# Altium schematic sheet MainLogic.SchDoc
size A2; SheetNumber: 1; SheetTotal: 1
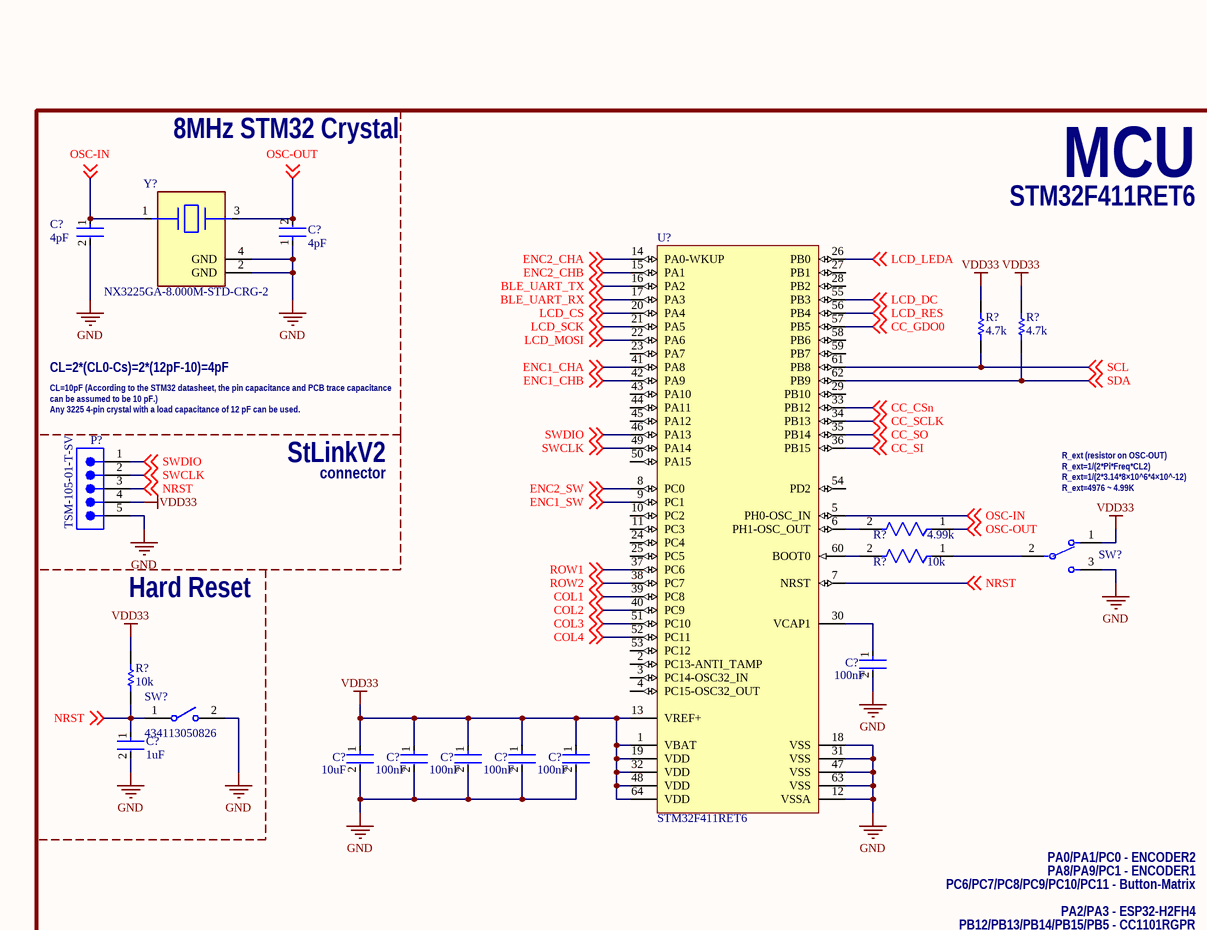
[diagram p0: MainLogic.SchDoc, top left]
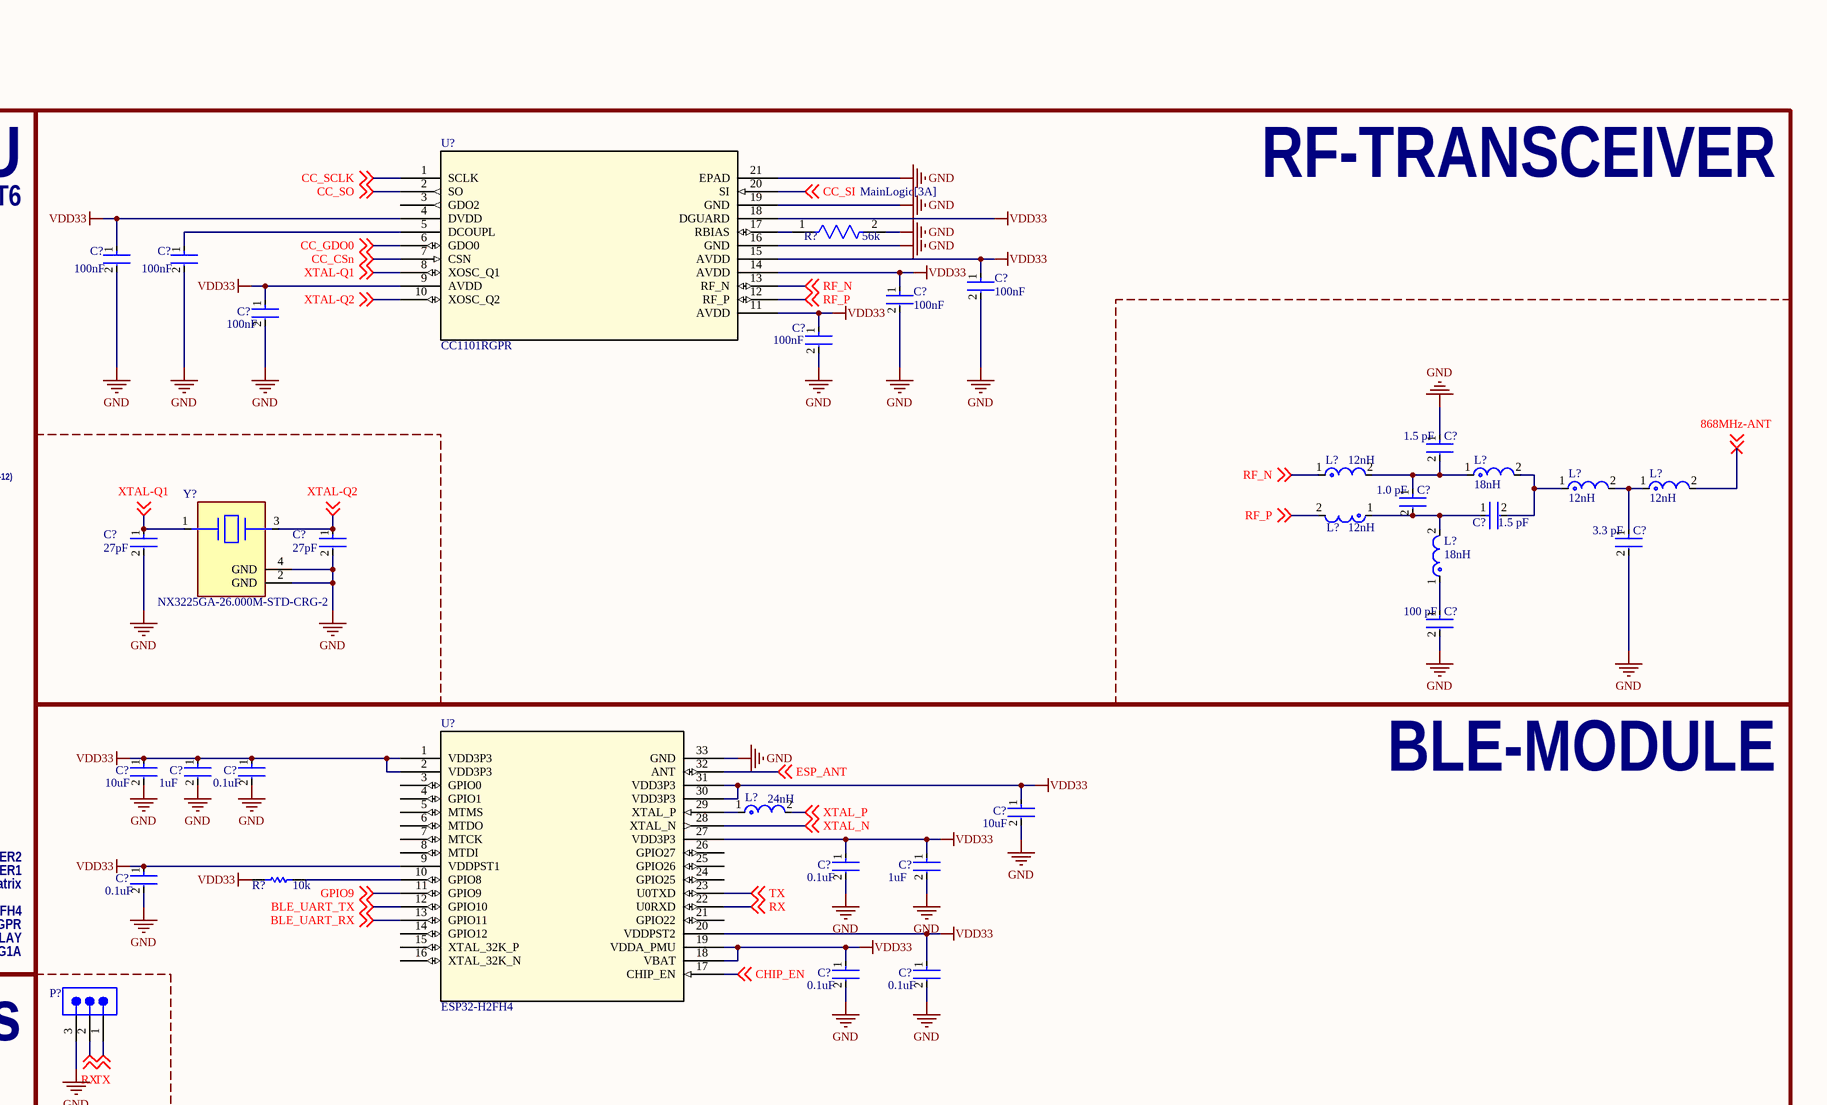
[diagram p1: MainLogic.SchDoc, top right]
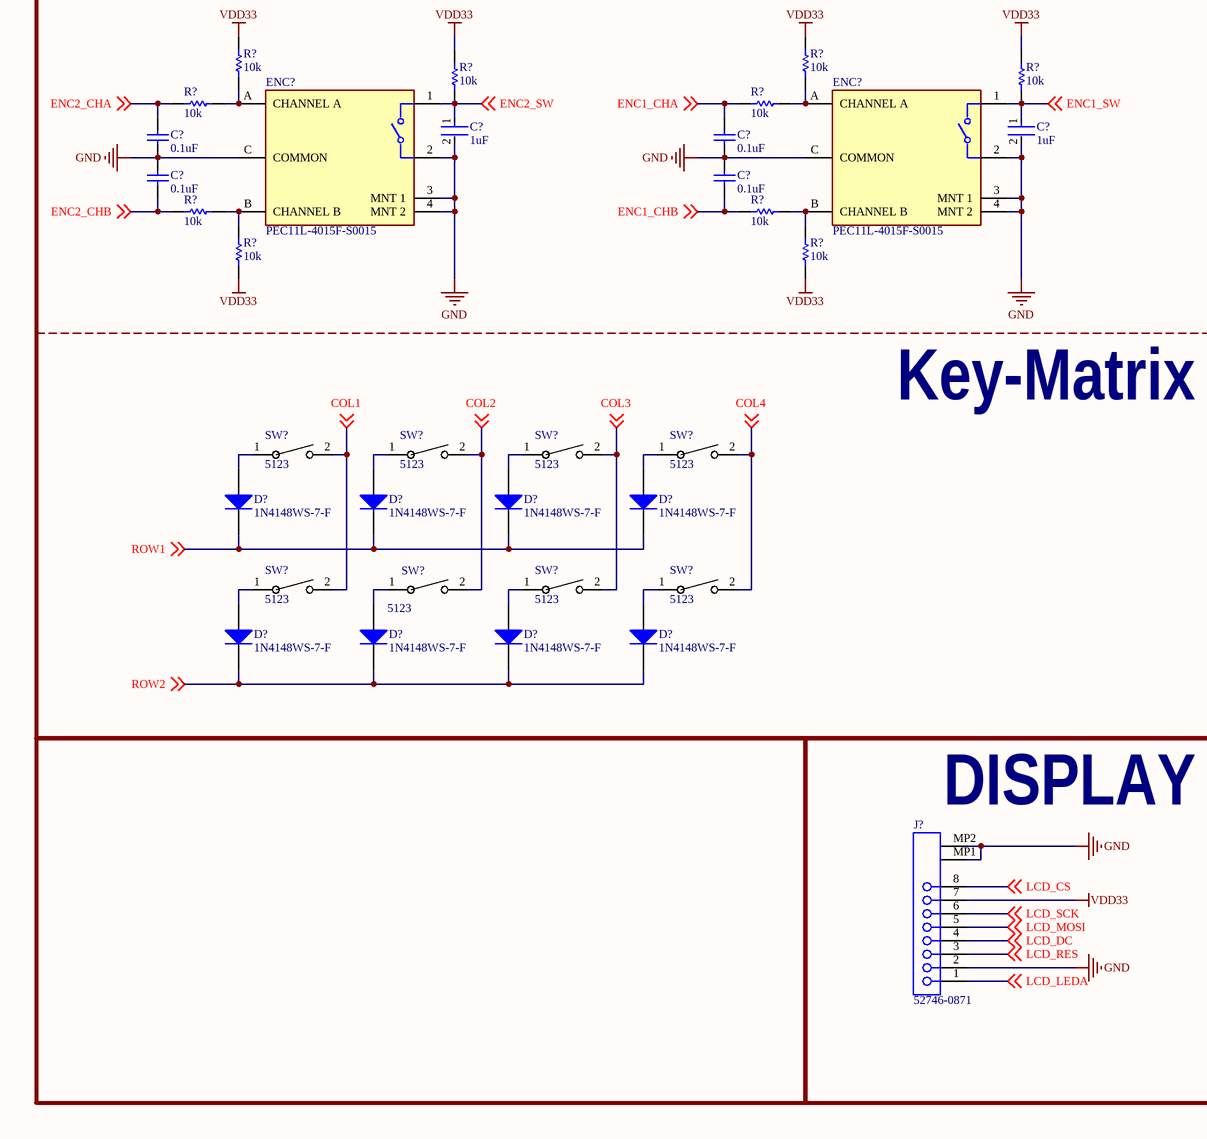
[diagram p2: MainLogic.SchDoc, bottom left]
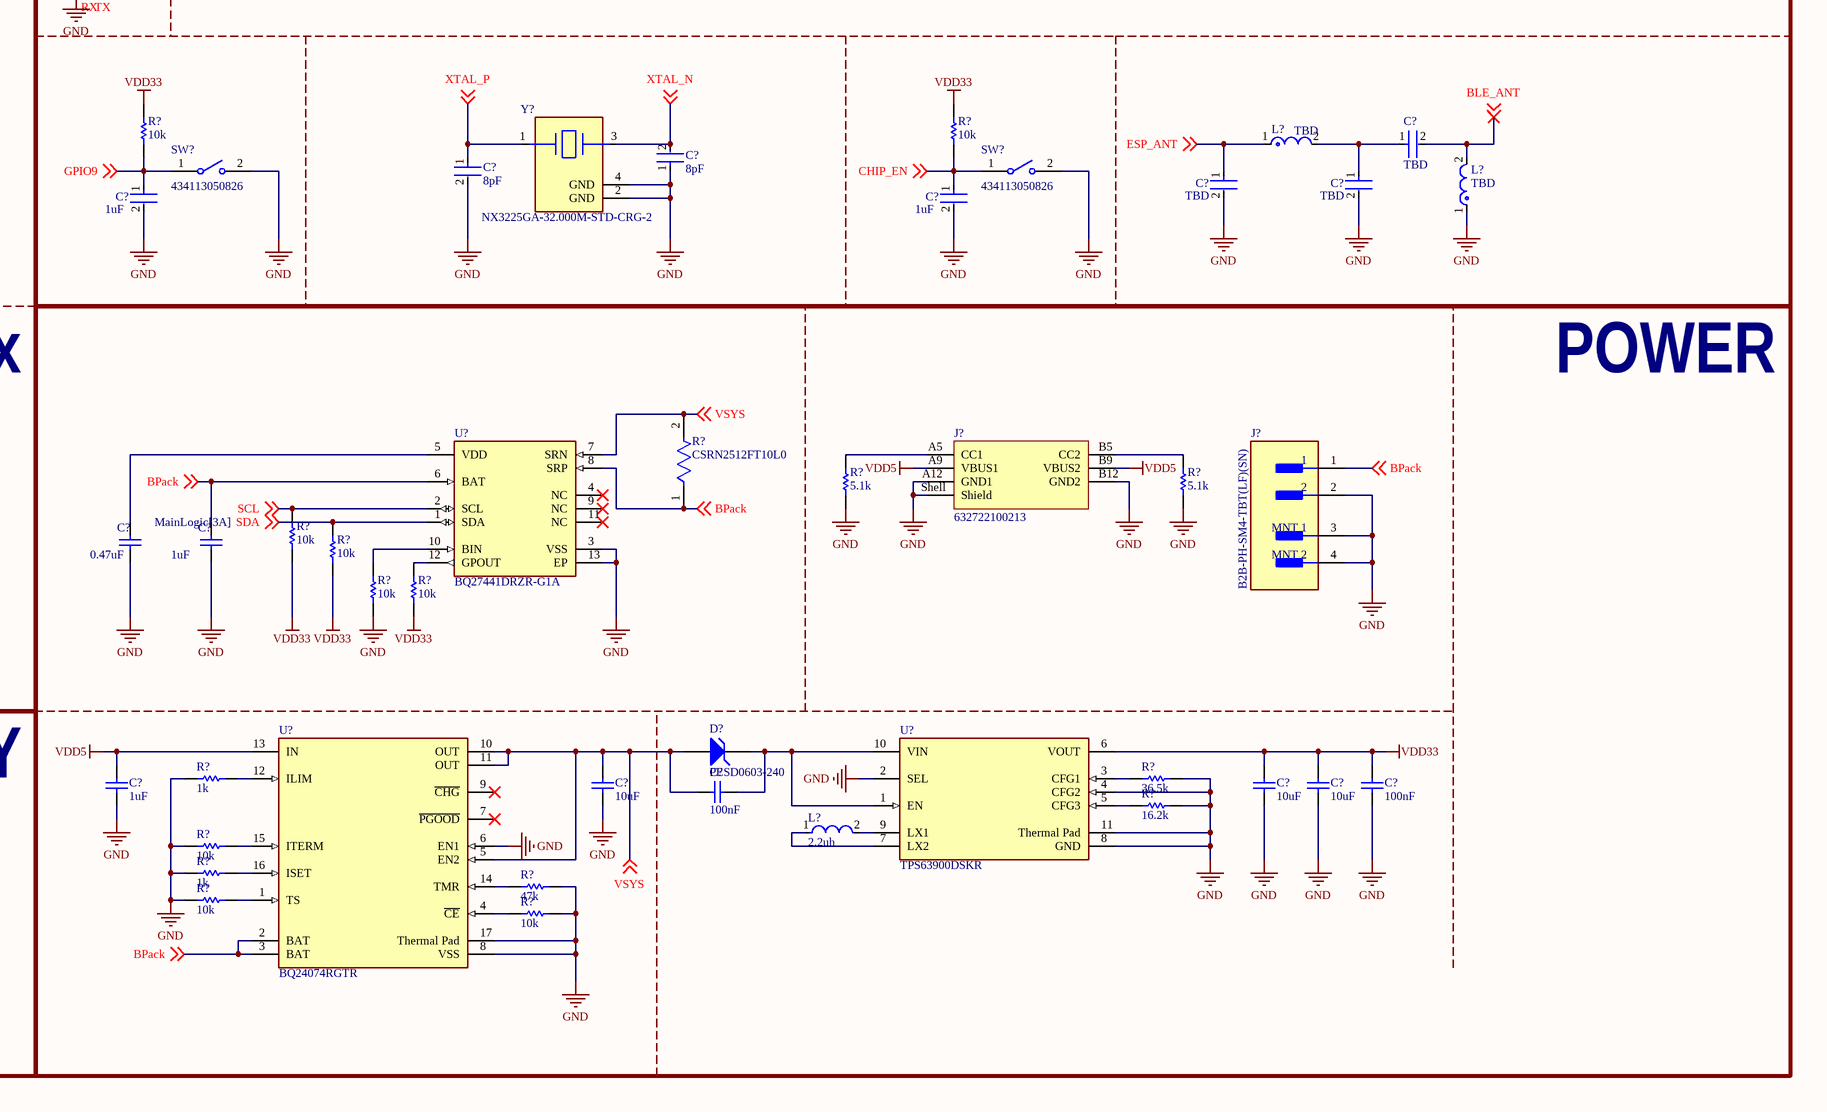
[diagram p3: MainLogic.SchDoc, bottom right]

## Parts
(Parts that share a designator on the sheet are numbered #1, #2 ... from top to bottom, then left to right.)
C?#1  4pF  [FP-GRM155-0_05-IPC_A]
C?#2  4pF  [FP-GRM155-0_05-IPC_A]
C?#3  100nF  [FP-GRM155-0_05-MFG]
C?#4  100nF  [FP-GRM155-0_05-MFG]
C?#5  100nF  [FP-GRM155-0_05-MFG]
C?#6  100nF  [FP-GRM155-0_05-MFG]
C?#7  100nF  [FP-GRM155-0_05-MFG]
C?#8  100nF  [FP-GRM155-0_05-MFG]
C?#9  1.5 pF  [FP-GRM155-0_05-IPC_A]
C?#10  1.0 pF  [FP-GRM155-0_05-IPC_A]
C?#11  1.5 pF  [FP-GRM155-0_05-IPC_A]
C?#12  27pF  [FP-GRM155-0_05-IPC_A]
C?#13  27pF  [FP-GRM155-0_05-IPC_A]
C?#14  3.3 pF  [FP-GRM155-0_05-IPC_A]
C?#15  100 pF  [FP-GRM155-0_05-IPC_A]
C?#16  100nF  [FP-GRM155-0_05-MFG]
C?#17  1uF  [FP-GRM155-0_05-MFG]
C?#18  10uF  [FP-GRM155-0_05-MFG]
C?#19  100nF  [FP-GRM155-0_05-MFG]
C?#20  100nF  [FP-GRM155-0_05-MFG]
C?#21  100nF  [FP-GRM155-0_05-MFG]
C?#22  100nF  [FP-GRM155-0_05-MFG]
C?#23  10uF  [FP-GRM155-0_05-MFG]
C?#24  1uF  [FP-GRM155-0_05-MFG]
C?#25  0.1uF  [FP-GRM155-0_05-MFG]
C?#26  10uF  [FP-GRM155-0_05-MFG]
C?#27  0.1uF  [FP-GRM155-0_05-MFG]
C?#28  1uF  [FP-GRM155-0_05-MFG]
C?#29  0.1uF  [FP-GRM155-0_05-MFG]
C?#30  0.1uF  [FP-GRM155-0_05-MFG]
C?#31  0.1uF  [FP-GRM155-0_05-MFG]
C?#32  1uF  [FP-GRM155-0_05-MFG]
C?#33  1uF  [FP-GRM155-0_05-MFG]
C?#34  0.1uF  [CAPC2013X94X50NL20T25]
C?#35  0.1uF  [CAPC2013X94X50NL20T25]
C?#36  TBD  [FP-GRM155-0_05-MFG]
C?#37  0.1uF  [CAPC2013X94X50NL20T25]
C?#38  0.1uF  [CAPC2013X94X50NL20T25]
C?#39  8pF  [FP-GRM155-0_05-IPC_A]
C?#40  8pF  [FP-GRM155-0_05-IPC_A]
C?#41  TBD  [FP-GRM155-0_05-MFG]
C?#42  TBD  [FP-GRM155-0_05-MFG]
C?#43  1uF  [FP-GRM155-0_05-MFG]
C?#44  1uF  [FP-GRM155-0_05-MFG]
C?#45  0.47uF  [CAPC2013X94X50NL20T25]
C?#46  1uF  [CAPC2013X94X50NL20T25]
C?#47  10uF  [CAPC2013X94X50NL20T25]
C?#48  10uF  [CAPC2013X94X50NL20T25]
C?#49  100nF  [CAPC2013X94X50NL20T25]
C?#50  1uF  [CAPC2013X94X50NL20T25]
C?#51  10uF  [CAPC2013X94X50NL20T25]
C?#52  100nF  [CAPC2013X94X50NL20T25]
D?#1  1N4148WS-7-F  [DIOD-SOD323-2-A_V]
D?#2  1N4148WS-7-F  [DIOD-SOD323-2-A_V]
D?#3  1N4148WS-7-F  [DIOD-SOD323-2-A_V]
D?#4  1N4148WS-7-F  [DIOD-SOD323-2-A_V]
D?#5  1N4148WS-7-F  [DIOD-SOD323-2-A_V]
D?#6  1N4148WS-7-F  [DIOD-SOD323-2-A_V]
D?#7  1N4148WS-7-F  [DIOD-SOD323-2-A_V]
D?#8  1N4148WS-7-F  [DIOD-SOD323-2-A_V]
D?#9  PESD0603-240  [TECO-0603_V]
ENC?#1  PEC11L-4015F-S0015  [FP-PEC11L-4015F-S0015-MFG]
ENC?#2  PEC11L-4015F-S0015  [FP-PEC11L-4015F-S0015-MFG]
J?#1  632722100213  [632722100213]
J?#2  B2B-PH-SM4-TBT(LF)(SN)  [FP-B2B-PH-SM4-TBT_LF_SN-MFG]
J?#3  52746-0871  [MOLX-52746-0871]
L?#1  12nH  [FP-LQG15WH_02-IPC_C]
L?#2  18nH  [FP-LQG15WH_02-IPC_C]
L?#3  12nH  [FP-LQG15WH_02-IPC_C]
L?#4  12nH  [FP-LQG15WH_02-IPC_C]
L?#5  12nH  [FP-LQG15WH_02-IPC_C]
L?#6  18nH  [FP-LQG15WH_02-IPC_C]
L?#7  24nH  [FP-LQG15WH_02-MFG]
L?#8  TBD  [FP-LQG15WH_02-MFG]
L?#9  TBD  [FP-LQG15WH_02-MFG]
L?#10  2.2uh  [FP-IHLP-5050FD-FP_3_226x4-MFG]
P?#1  TSM-105-01-T-SV  [SMTC-TSM-105-01-X-SV]
P?#2  MTSW-103-08-G-S-229-RA  [SMTC-MTSW-103-08-X-S-229-RA]  (value not drawn)
R?#1  56k  [FP-CRGCQ0402-IPC_C]
R?#2  4.7k  [RESC0805(2012)_M]
R?#3  4.7k  [RESC0805(2012)_M]
R?#4  4.99k  [FP-CRGCQ0402-IPC_C]
R?#5  10k  [FP-CRGCQ0402-IPC_C]
R?#6  10k  [RESC0805(2012)_M]
R?#7  10k  [RESC0805(2012)_M]
R?#8  10k  [RESC0805(2012)_M]
R?#9  10k  [RESC0805(2012)_M]
R?#10  10k  [RESC0805(2012)_M]
R?#11  10k  [RESC0805(2012)_M]
R?#12  10k  [RESC0805(2012)_M]
R?#13  10k  [RESC0805(2012)_M]
R?#14  10k  [RESC0805(2012)_M]
R?#15  10k  [RESC0805(2012)_M]
R?#16  10k  [RESC0805(2012)_M]
R?#17  10k  [RESC0805(2012)_M]
R?#18  10k  [RESC0805(2012)_M]
R?#19  10k  [RESC0805(2012)_M]
R?#20  5.1k  [RESC0805(2012)_M]
R?#21  5.1k  [RESC0805(2012)_M]
R?#22  CSRN2512FT10L0  [FP-CSRN2512-IPC_B]
R?#23  10k  [RESC0805(2012)_M]
R?#24  10k  [RESC0805(2012)_M]
R?#25  10k  [RESC0805(2012)_M]
R?#26  10k  [RESC0805(2012)_M]
R?#27  1k  [RESC0805(2012)_M]
R?#28  36.5k  [RESC0805(2012)_M]
R?#29  16.2k  [RESC0805(2012)_M]
R?#30  10k  [RESC0805(2012)_M]
R?#31  1k  [RESC0805(2012)_M]
R?#32  47k  [RESC0805(2012)_M]
R?#33  10k  [RESC0805(2012)_M]
R?#34  10k  [RESC0805(2012)_M]
SW?#1  (no value)  [FP-JS102011SAQN-MFG]
SW?#2  434113050826  [434113050826]
SW?#3  434113050826  [434113050826]
SW?#4  434113050826  [434113050826]
SW?#5  5123  [Kailh_socket_MX]
SW?#6  5123  [Kailh_socket_MX]
SW?#7  5123  [Kailh_socket_MX]
SW?#8  5123  [Kailh_socket_MX]
SW?#9  5123  [Kailh_socket_MX]
SW?#10  5123  [Kailh_socket_MX]
SW?#11  5123  [Kailh_socket_MX]
SW?#12  5123  [Kailh_socket_MX]
U?#1  CC1101RGPR  [RGP20_2P4X2P4]
U?#2  STM32F411RET6  [STM-LQFP64_L]
U?#3  ESP32-H2FH4  [QFN324X4_EXP]
U?#4  BQ27441DRZR-G1A  [FP-DRZ0012A-MFG]
U?#5  BQ24074RGTR  [FP-RGT0016C-IPC_B]
U?#6  TPS63900DSKR  [FP-DSK0010A-IPC_C]
Y?#1  NX3225GA-8.000M-STD-CRG-2  [FP-NX3225GA-MFG]
Y?#2  NX3225GA-26.000M-STD-CRG-2  [FP-NX3225GA-MFG]
Y?#3  NX3225GA-32.000M-STD-CRG-2  [FP-NX3225GA-MFG]

## Blocks framed on the sheet
POWER: C?#45-C?#52 D?#9 J?#1 J?#2 L?#10 R?#20-R?#34 U?#4-U?#6
DISPLAY: J?#3

## Nets
GND: C?#1.2 C?#2.1 C?#3.2 C?#4.2 C?#5.2 C?#6.2 C?#7.2 C?#8.2 C?#9.1 C?#12.2 C?#13.2 C?#14.2 C?#15.2 C?#16.2 C?#17.2 C?#18.2 C?#19.2 C?#20.2 C?#21.2 C?#22.2 C?#23.2 C?#24.2 C?#25.2 C?#26.2 C?#27.2 C?#28.2 C?#29.2 C?#30.2 C?#31.2 C?#32.2 C?#33.2 C?#34.1 C?#35.1 C?#37.2 C?#38.2 C?#39.2 C?#40.1 C?#41.2 C?#42.2 C?#43.2 C?#44.2 C?#45.1 C?#46.1 C?#47.2 C?#48.2 C?#49.2 C?#50.1 C?#51.1 ENC?#1.2 ENC?#1.3(MNT_1) ENC?#1.4(MNT_2) ENC?#1.C(COMMON) ENC?#2.2 ENC?#2.3(MNT_1) ENC?#2.4(MNT_2) ENC?#2.C(COMMON) J?#1.A12(GND1) J?#1.B12(GND2) J?#1.Shell(Shield) J?#2.2 J?#2.3(MNT_1) J?#2.4(MNT_2) J?#3.2 J?#3.MP1 J?#3.MP2 L?#9.1 P?#1.5 P?#2.3 R?#1.2 R?#20.2 R?#21.2 R?#25.1 R?#27.1 R?#28.2 R?#29.2 R?#30.1 R?#31.1 R?#32.2 R?#33.1 R?#34.2 SW?#1.3 SW?#2.2 SW?#3.2 SW?#4.2 U?#1.16(GND) U?#1.19(GND) U?#1.21(EPAD) U?#2.12(VSSA) U?#2.18(VSS) U?#2.31(VSS) U?#2.47(VSS) U?#2.63(VSS) U?#3.33(GND) U?#4.3(VSS) U?#4.13(EP) U?#5.6(EN1) U?#5.8(VSS) U?#5.17(Thermal_Pad) U?#6.2(SEL) U?#6.4(CFG2) U?#6.8(GND) U?#6.11(Thermal_Pad) Y?#1.2(GND) Y?#1.4(GND) Y?#2.2(GND) Y?#2.4(GND) Y?#3.2(GND) Y?#3.4(GND)
VDD5: C?#50.2 J?#1.A9(VBUS1) J?#1.B9(VBUS2) U?#5.13(IN)
VDD33: C?#3.1 C?#5.1 C?#6.1 C?#7.1 C?#8.1 C?#18.1 C?#19.1 C?#20.1 C?#21.1 C?#22.1 C?#23.1 C?#24.1 C?#25.1 C?#26.1 C?#27.1 C?#28.1 C?#29.1 C?#30.1 C?#31.1 C?#47.1 C?#48.1 C?#49.1 J?#3.7 P?#1.4 R?#2.1 R?#3.1 R?#6.2 R?#7.1 R?#8.1 R?#9.1 R?#10.1 R?#11.1 R?#14.1 R?#15.1 R?#18.1 R?#19.1 R?#23.1 R?#24.1 R?#26.1 SW?#1.1 U?#1.4(DVDD) U?#1.9(AVDD) U?#1.11(AVDD) U?#1.14(AVDD) U?#1.15(AVDD) U?#1.18(DGUARD) U?#2.1(VBAT) U?#2.13(VREF+) U?#2.19(VDD) U?#2.32(VDD) U?#2.48(VDD) U?#2.64(VDD) U?#3.1(VDD3P3) U?#3.2(VDD3P3) U?#3.9(VDDPST1) U?#3.18(VBAT) U?#3.19(VDDA_PMU) U?#3.20(VDDPST2) U?#3.27(VDD3P3) U?#3.30(VDD3P3) U?#3.31(VDD3P3) U?#6.6(VOUT)
868MHz-ANT: L?#4.2 ; off-sheet 868MHz-ANT
BLE_ANT: C?#36.2 L?#9.2 ; off-sheet BLE_ANT
BLE_UART_RX: U?#2.17(PA3) U?#3.13(GPIO11) ; off-sheet BLE_UART_RX
BLE_UART_TX: U?#2.16(PA2) U?#3.12(GPIO10) ; off-sheet BLE_UART_TX
BPack: C?#46.2 J?#2.1 R?#22.1 U?#4.6(BAT) U?#4.8(SRP) U?#5.2(BAT) U?#5.3(BAT) ; off-sheet BPack
CC_CSn: U?#1.7(CSN) U?#2.33(PB12) ; off-sheet CC_CSn
CC_GDO0: U?#1.6(GDO0) U?#2.57(PB5) ; off-sheet CC_GDO0
CC_SCLK: U?#1.1(SCLK) U?#2.34(PB13) ; off-sheet CC_SCLK
CC_SI: U?#1.20(SI) U?#2.36(PB15) ; off-sheet CC_SI
CC_SO: U?#1.2(SO) U?#2.35(PB14) ; off-sheet CC_SO
CHIP_EN: C?#44.1 R?#15.2 SW?#4.1 U?#3.17(CHIP_EN) ; off-sheet CHIP_EN
COL1: SW?#5.2 SW?#9.2 U?#2.39(PC8) ; off-sheet COL1
COL2: SW?#6.2 SW?#10.2 U?#2.40(PC9) ; off-sheet COL2
COL3: SW?#7.2 SW?#11.2 U?#2.51(PC10) ; off-sheet COL3
COL4: SW?#8.2 SW?#12.2 U?#2.52(PC11) ; off-sheet COL4
ENC1_CHA: C?#35.2 R?#13.1 U?#2.41(PA8) ; off-sheet ENC1_CHA
ENC1_CHB: C?#38.1 R?#17.1 U?#2.42(PA9) ; off-sheet ENC1_CHB
ENC1_SW: C?#33.1 ENC?#2.1 R?#11.2 U?#2.9(PC1) ; off-sheet ENC1_SW
ENC2_CHA: C?#34.2 R?#12.1 U?#2.14(PA0-WKUP) ; off-sheet ENC2_CHA
ENC2_CHB: C?#37.1 R?#16.1 U?#2.15(PA1) ; off-sheet ENC2_CHB
ENC2_SW: C?#32.1 ENC?#1.1 R?#10.2 U?#2.8(PC0) ; off-sheet ENC2_SW
ESP_ANT: C?#41.1 L?#8.1 U?#3.32(ANT) ; off-sheet ESP_ANT
GPIO9: C?#43.1 R?#14.2 SW?#3.1 U?#3.11(GPIO9) ; off-sheet GPIO9
LCD_CS: J?#3.8 U?#2.20(PA4) ; off-sheet LCD_CS
LCD_DC: J?#3.4 U?#2.55(PB3) ; off-sheet LCD_DC
LCD_LEDA: J?#3.1 U?#2.26(PB0) ; off-sheet LCD_LEDA
LCD_MOSI: J?#3.5 U?#2.22(PA6) ; off-sheet LCD_MOSI
LCD_RES: J?#3.3 U?#2.56(PB4) ; off-sheet LCD_RES
LCD_SCK: J?#3.6 U?#2.21(PA5) ; off-sheet LCD_SCK
NRST: C?#17.1 P?#1.3 R?#6.1 SW?#2.1 U?#2.7(NRST) ; off-sheet NRST
OSC-IN: C?#1.1 U?#2.5(PH0-OSC_IN) Y?#1.1 ; off-sheet OSC-IN
OSC-OUT: C?#2.2 R?#4.1 Y?#1.3 ; off-sheet OSC-OUT
RF_N: L?#1.1 U?#1.13(RF_N) ; off-sheet RF_N
RF_P: L?#5.2 U?#1.12(RF_P) ; off-sheet RF_P
ROW1: D?#1.2(K) D?#2.2(K) D?#3.2(K) D?#4.2(K) U?#2.37(PC6) ; off-sheet ROW1
ROW2: D?#5.2(K) D?#6.2(K) D?#7.2(K) D?#8.2(K) U?#2.38(PC7) ; off-sheet ROW2
RX: P?#2.2 U?#3.22(U0RXD) ; off-sheet RX
SCL: R?#2.2 R?#23.2 U?#2.61(PB8) U?#4.2(SCL) ; off-sheet SCL
SDA: R?#3.2 R?#24.2 U?#2.62(PB9) U?#4.1(SDA) ; off-sheet SDA
SWCLK: P?#1.2 U?#2.49(PA14) ; off-sheet SWCLK
SWDIO: P?#1.1 U?#2.46(PA13) ; off-sheet SWDIO
TX: P?#2.1 U?#3.23(U0TXD) ; off-sheet TX
VSYS: C?#51.2 C?#52.2 D?#9.1(A) R?#22.2 U?#4.7(SRN) U?#5.5(EN2) U?#5.10(OUT) U?#5.11(OUT) ; off-sheet VSYS
XTAL-Q1: C?#12.1 U?#1.8(XOSC_Q1) Y?#2.1 ; off-sheet XTAL-Q1
XTAL-Q2: C?#13.1 U?#1.10(XOSC_Q2) Y?#2.3 ; off-sheet XTAL-Q2
XTAL_N: C?#40.2 U?#3.28(XTAL_N) Y?#3.3 ; off-sheet XTAL_N
XTAL_P: C?#39.1 L?#7.2 Y?#3.1 ; off-sheet XTAL_P
NetC?#4_1: C?#4.1 U?#1.5(DCOUPL)
NetC?#9_2: C?#9.2 C?#10.1 L?#1.2 L?#2.1
NetC?#10_2: C?#10.2 C?#11.1 L?#5.1 L?#6.2
NetC?#11_2: C?#11.2 L?#2.2 L?#3.1
NetC?#14_1: C?#14.1 L?#3.2 L?#4.1
NetC?#15_1: C?#15.1 L?#6.1
NetC?#16_1: C?#16.1 U?#2.30(VCAP1)
NetC?#36_1: C?#36.1 C?#42.1 L?#8.2
NetC?#45_2: C?#45.2 U?#4.5(VDD)
NetC?#52_1: C?#52.1 D?#9.2(K) U?#6.1(EN) U?#6.10(VIN)
NetD?#1_1: D?#1.1(A) SW?#5.1
NetD?#2_1: D?#2.1(A) SW?#6.1
NetD?#3_1: D?#3.1(A) SW?#7.1
NetD?#4_1: D?#4.1(A) SW?#8.1
NetD?#5_1: D?#5.1(A) SW?#9.1
NetD?#6_1: D?#6.1(A) SW?#10.1
NetD?#7_1: D?#7.1(A) SW?#11.1
NetD?#8_1: D?#8.1(A) SW?#12.1
NetENC?#1_A: ENC?#1.A(CHANNEL_A) R?#8.2 R?#12.2
NetENC?#1_B: ENC?#1.B(CHANNEL_B) R?#16.2 R?#18.2
NetENC?#2_A: ENC?#2.A(CHANNEL_A) R?#9.2 R?#13.2
NetENC?#2_B: ENC?#2.B(CHANNEL_B) R?#17.2 R?#19.2
NetJ?#1_A5: J?#1.A5(CC1) R?#20.1
NetJ?#1_B5: J?#1.B5(CC2) R?#21.1
NetL?#7_1: L?#7.1 U?#3.29(XTAL_P)
NetL?#10_1: L?#10.1 U?#6.7(LX2)
NetL?#10_2: L?#10.2 U?#6.9(LX1)
NetR?#1_1: R?#1.1 U?#1.17(RBIAS)
NetR?#4_2: R?#4.2 U?#2.6(PH1-OSC_OUT)
NetR?#5_1: R?#5.1 SW?#1.2(C)
NetR?#5_2: R?#5.2 U?#2.60(BOOT0)
NetR?#7_2: R?#7.2 U?#3.10(GPIO8)
NetR?#25_2: R?#25.2 U?#4.10(BIN)
NetR?#26_2: R?#26.2 U?#4.12(GPOUT)
NetR?#27_2: R?#27.2 U?#5.12(ILIM)
NetR?#28_1: R?#28.1 U?#6.3(CFG1)
NetR?#29_1: R?#29.1 U?#6.5(CFG3)
NetR?#30_2: R?#30.2 U?#5.15(ITERM)
NetR?#31_2: R?#31.2 U?#5.16(ISET)
NetR?#32_1: R?#32.1 U?#5.14(TMR)
NetR?#33_2: R?#33.2 U?#5.1(TS)
NetR?#34_1: R?#34.1 U?#5.4(~{CE})

Not connected (* = marked no-connect by the designer): U?#1 3(GDO2); U?#2 2(PC13-ANTI_TAMP) 3(PC14-OSC32_IN) 4(PC15-OSC32_OUT) 10(PC2) 11(PC3) 23(PA7) 24(PC4) 25(PC5) 27(PB1) 28(PB2) 29(PB10) 43(PA10) 44(PA11) 45(PA12) 50(PA15) 53(PC12) 54(PD2) 58(PB6) 59(PB7); U?#3 3(GPIO0) 4(GPIO1) 5(MTMS) 6(MTDO) 7(MTCK) 8(MTDI) 14(GPIO12) 15(XTAL_32K_P) 16(XTAL_32K_N) 21(GPIO22) 24(GPIO25) 25(GPIO26) 26(GPIO27); U?#4 4(NC)* 9(NC)* 11(NC)*; U?#5 7(~{PGOOD})* 9(~{CHG})*

## Notes on the sheet
- 8MHz STM32 Crystal
- MCU
- RF-TRANSCEIVER
- STM32F411RET6
- CL=2*(CL0-Cs)=2*(12pF-10)=4pF
- (near P?#1) CL=10pF (According to the STM32 datasheet, the pin capacitance and PCB trace capacitance can be assumed to be 10 pF.)
  Any 3225 4-pin crystal with a load capacitance of 12 pF can be used.
- StLinkV2
- connector
- R_ext (resistor on OSC-OUT)
  R_ext=1/(2*Pi*Freq*CL2)
  R_ext=1/(2*3.14*8×10^6*4×10^-12)
  R_ext=4976 ~ 4.99K
- Hard Reset
- BLE-MODULE
- PA0/PA1/PC0 - ENCODER2
- PA8/PA9/PC1 - ENCODER1
- PC6/PC7/PC8/PC9/PC10/PC11 - Button-Matrix
- PB12/PB13/PB14/PB15/PB5 - CC1101RGPR
- PA2/PA3 - ESP32-H2FH4
- PA4/PA5/PA6/PB3/PB4 - LCD-DISPLAY
- PB8/PB9 - BQ27441DRZR-G1A
- Encoders
- Key-Matrix

## Library data of the parts
C?#1 C?#2 C?#9-C?#15 C?#39 C?#40 = CMP-2008-04370-2: Chip Multilayer Ceramic Capacitors for General Purpose, 0402, 470pF, C0G, 30ppm/°C, 5%, 50V; Termination: SMD/SMT; Voltage: 50V; Voltage Rating: 50V; Max Operating Temperature: 125°C; Mount: Surface Mount; Lead Free: Lead Free; Case Code (Metric): 1005; Depth: 0.5mm; Packaging: Tape and Reel; Package Quantity: 50000; Width: 0.02inch; Tolerance: 5%; Radiation Hardening: No; Min Operating Temperature: -55°C; Thickness: 0.022inch; Length: 1mm; Voltage Rating (DC): 50V; Case Code (Imperial): 0402; Height: 0.5mm; Capacitance: 470pF; Case/Package: 0402; Dielectric: C0G
C?#3-C?#8 C?#16 C?#19-C?#22 = CMP-06035-019038-1: Chip Multilayer Ceramic Capacitors for General Purpose, 0402, 0.10uF, X7S, 22%, 10%, 50V; Voltage Rating (DC): 50V; Dielectric: X7S; Width: 500um; Thickness: 500um; Length: 1mm; Tolerance: 10%; Capacitance: 100nF
C?#17 C?#18 C?#23-C?#33 C?#36 C?#41-C?#44 = CMP-06035-019038-1: Chip Multilayer Ceramic Capacitors for General Purpose, 0402, 0.10uF, X7S, 22%, 10%, 50V; Capacitance: 100nF; Voltage Rating (DC): 50V; Dielectric: X7S; Width: 500um; Thickness: 500um; Length: 1mm; Tolerance: 10%
C?#34 C?#35 C?#37 C?#38 C?#45-C?#52 = CMP-2007-04406-1: Part Number: 08055C331JAT2A; Manufacturer: AVX Interconnect / Elco
D?#1-D?#8 = CMP-1667-00004-1: Fast Switching Diode, 75 V, 0.3 A, -65 to 150 degC, 2-Pin SOD323, RoHS, Tape and Reel; DatasheetVersion: Rev. 25-2, 03/2016; PackageDescription: 2-Pin Small Outline Diode, Body 1.7 x 1.3 mm; ComponentLink2Description: Datasheet; ComponentLink1URL: http://www.diodes.com/; PackageReference: SOD323-2; ComponentLink2URL: http://www.diodes.com/datasheets/ds30097.pdf; ComponentLink1Description: Manufacturer URL
D?#9 = CMP-2000-06889-1: ESD Protector Overvoltage Protection Device, 0.25 pF, 24 V, -55 to 125 degC, 2-Pin SMD (0603), RoHS, Tape and Reel; Manufacturer: TE Connectivity; Capacitance Value: 0.25pF; Rad Hardened: No; Leakage Current (Max): 10uA; Clamping Voltage: 45(Typ)V; Product Height (mm): 0.55mm; Working Voltage: 24V; Product Length (mm): 1.7(Max)mm; Direction Type: Bi-Directional; Number of  Elements: 1; Product Depth (mm): 1(Max)mm; Datasheet Version: Rev. G, 11/2012; Package Reference: 0603; Operating Temperature Max Deg. C: 125C; Packaging: TapeandReel/Box; Leakage Current: 10uA; Datasheet URL: https://datasheet.ciiva.com/30563/eng-ss-scd27256-c-30563476.pdf; Mounting: SurfaceMount; Manufacturer URL: http://www.te.com/; Operating Temperature Classification: Military; Reverse Stand-off Voltage: 24V; Working Voltage (Max): 24V; Mounting Style: SurfaceMount; Operating Temperature Min Deg. C: -55C; Operating Temp Range: -55Cto125C; Pin Count: 2; Mounting Technology: SurfaceMount; Package Description: 2-Pin Surface Mount Device, Body 1.60 x 0.825 mm
ENC?#1 ENC?#2 = CMP-07421-000033-1: ROTARY ENCODER MECHANICAL 15PPR; Built in Switch: Yes; Detent: No; Output Type: Quadrature; Number of Channels: 2; Pulses per Revolution: 15; Orientation: Vertical; Series: PEC11; Min Operating Temperature: -25°C; Max Operating Temperature: 80°C; Width: 11.8mm; Length: 19.5mm; Package Quantity: 75; Number of Pins: 5; Termination: PC Pin; Encoder Type: Mechanical; Packaging: Bulk; Mount: Through Hole; RoHS Compliant: Yes; Height: 12mm
J?#1 = CMP-03913-147573503-1: Usb Conn, Type-c, Rcpt, 6POS Rohs Compliant: Yes
J?#2 = CMP-17439-000005-1: CONN HEADER SMD 2POS 2MM; Manufacturer: JST; Current Rating: 2A; Conn Gender: Male; Voltage Rating: 100V; Conn Orientation: Vertical; Number Of Contacts: 2; Octopart: https://octopart.com/b2b-ph-sm4-tbt%28lf%29%28sn%29-jst-7877930; Number Of Rows: 1; Device Class L2: Headers and Wire Housings; RoHS: TRUE; Contact Material: Tin,Copper; Height: 6.65mm; Temperature: -25°C to +85°C; Temperature Range Low: -25°C; ComponentLink2Description: Datasheet; Manufacturer Part Number: B2B-PH-SM4-TBT(LF)(SN); ComponentLink2URL: http://www.jst-mfg.com/product/pdf/eng/ePH.pdf; Automotive: No; Pitch: 2mm; Lead Free: Yes; Device Class L3: unset; Category: Conn; Digikey Description: CONN HEADER SMD 2POS 2MM; Temperature Range High: +85°C; Package: 0; Device Class L1: Connectors
J?#3 = CMP-1241-00370-1: 0.5 mm Pitch Easy-On(TM) Type FPC Connector, 2.0 mm Mated Height, Right Angle, ZIF, SMT, Bottom Contact, 8 Circuits, -20 to 85 degC, ELV and RoHS Compliant, Tape and Reel; Manufacturer: Molex; PCB Locator: No; Mated Height: 2.00mm; Durability (mating cycles max): 20; Polarized to PCB: Yes; Voltage (Max): 50V; Pitch - Mating Interface: 0.50mm; Material - Plating Termination: Gold; Entry Angle: 90degrees Angle; Circuits (Loaded): 8; Material - Metal: Phosphor Bronze; Current (Max per Contact): 0.5A; ComponentLink3URL: http://www.molex.com/pdm_docs/sd/527460871_sd.pdf; PackageDescription: 8-Lead FPC Connector, Pitch 0.5 mm; ComponentLink1URL: http://www.molex.com/molex/index.jsp; ComponentLink2URL: http://www.molex.com/webdocs/datasheets/pdf/en-us/0527460871_FFC_FPC_CONNECTORS.pdf; RoHS: TRUE; PackageVersion: Rev. H, 05/2009; Mounting Technology: Surface Mount; ComponentLink2Description: Datasheet; PackageReference: 52746-0871; Orientation: Right Angle; Packing: Tape and Reel; Material - Plating Mating: Gold; PCB Retention: Yes; ComponentLink3Description: Package Specification; Contact Position: Bottom; PartNumber: 52746-0871; Number of Rows: 1; ComponentLink1Description: Manufacturer URL; Stackable: No
L?#1-L?#6 = CMP-06042-014976-1: Multilayer type Inductor for Automotive 12nH ±3% 0.24Ω 450mA 0402
L?#7-L?#9 = CMP-06042-002765-1: Multilayer type Inductor for Automotive 24nH ±3% 1.2Ω 230mA 0402
L?#10 = CMP-02424-000098-1: Automotive Inductors, High Temperature (180 °C) Series 2.2uH 25.5A 3.67mΩ 20%
P?#1 = CMP-1024-00239-1: 0.025" SQ Post Header, Surface Mount, Vertical, -55 to 105 degC, 2.54 mm Pitch, 5-Pin, Male, RoHS; Manufacturer: Samtec; Pitch: 2.54 mm; PartNumber: TSM-105-01-T-SV; ComponentLink3Description: Package Specification; PackageDescription: Single Row .100 SMT Assembly; ComponentLink2URL: http://www.samtec.com/documents/webfiles/pdf/TSM.PDF; RoHS: True; ComponentLink2Description: Datasheet; Mounting Technology: Surface Mount; DatasheetVersion: F-214; ComponentLink1Description: Manufacturer URL; ComponentLink3URL: http://www.samtec.com/documents/webfiles/cpdf/TSM-1XX-XX-XXX-SV-XX-XXX-XX-MKT.pdf; Orientation: Vertical; PackageVersion: BP, 8/2002; PackageReference: TSM-105-01-X-SV; ComponentLink1URL: http://www.samtec.com; Temperature Range: -55 to 105 degC
P?#2 = CMP-1024-00100-1: Modified .025" SQ Post Header, Through-hole, Right Angle, -55 to 125 degC, 2.54 mm Pitch, 3-Pin, Male, RoHS; Manufacturer: Samtec; Pitch: 2.54 mm; ComponentLink1URL: http://www.samtec.com; ComponentLink3Description: Package Specification; Mounting Technology: Through-hole; PackageDescription: Assembly .025" [.64] SQ Post Terminal Strip; ComponentLink2URL: http://www.samtec.com/documents/webfiles/pdf/MTSW.PDF; PackageVersion: BI, 2/1987; ComponentLink1Description: Manufacturer URL; PackageReference: MTSW-103-08-X-S-229-RA; Orientation: Right Angle; DatasheetVersion: F-214; PartNumber: MTSW-103-08-G-S-229-RA; RoHS: True; Temperature Range: -55 to 125 degC; ComponentLink3URL: http://www.samtec.com/documents/webfiles/cpdf/MTSW-XXX-XX-X-X-XXXX-XX-XXX-MKT1.pdf; ComponentLink2Description: Datasheet
R?#1 R?#4 R?#5 = CMP-03211-009184-1: CRGCQ 0402 56K 1%; Manufacturer Part Number: CRGCQ0402F56K; Manufacturer: TE Connectivity; Temperature Coefficient: ±100ppm/°C; Resistance: 56KΩ; Value: 56KΩ; Voltage Rating: 50V; Power Rating: 0.0625W; Tolerance: 0.01; Device Class L3: Chip SMD Resistors; ComponentLink2URL: https://www.te.com/commerce/DocumentDelivery/DDEController?Action=showdoc&DocId=Data+Sheet%7F1773204-3%7F1%7Fpdf%7FEnglish%7FENG_DS_1773204-3_1.pdf%7F4-2176347-1092; RoHS: TRUE; Octopart: https://octopart.com/crgcq0402f56k-te+connectivity-91017978; Composition: Thick Film; Height: 0.4mm; Ipc Land Pattern Name: RESC10050X35; Series: CRGCQ; Device Class L2: Resistors; Temperature: -55°C to +155°C; Device Class L1: Passive Components; Temperature Range Low: -55°C; Digikey Description: CRGCQ 0402 56K 1%; Lead Free: Yes; Automotive: Yes; ComponentLink2Description: Datasheet; Temperature Range High: +155°C; Ambient Temperature Range High: +70°C; Package: CRGCQ0402; Category: Res
R?#2 R?#3 R?#6-R?#21 R?#23-R?#34 = CMP-1013-00517-1: 1K18 0.125W 1% 0805 (2012 Metric)  SMD; Value: 1180.00 Ohm; Case-EIA: 0805; Case-Metric: 2012; Tolerance: 1 %; Technology: SMT; Power: 0.125 W
R?#22 = CMP-26527-000109-1: RES 0.01 OHM 1% 2W 2512; Temperature Coefficient: 200ppm/°C; Resistance: 10mR; Radiation Hardening: No; Contact Plating: Tin; Length: 0.25inch; Min Operating Temperature: -55°C; Max Power Dissipation: 2W; RoHS Compliant: Yes; Size Code: 2512; Mount: Surface Mount; Package Quantity: 4000; Max Operating Temperature: 155°C; Case/Package: 2512; Resistor Type: Thick Film; Power Rating: 2W; Series: CSRN; Width: 0.124inch; Packaging: Tape and Reel; Height: 0.028inch; Tolerance: 1%; Lead Free: Lead Free; Number of Terminations: 2
SW?#1 = CMP-2000-06501-2: SWITCH SLIDE SPDT 300MA 6V / JS102011SAQN; Switch Function: On-On; Illumination Type: Non-Illuminated; Switch Travel: 2mm; Contact Resistance: 70mR; Actuator Material: Nylon; Electrical Life: 5000Cycles; Actuator Type: Standard; Max Operating Temperature: 85°C; Housing Material: Nylon; Radiation Hardening: No; Max Voltage Rating (DC): 6V; Package Quantity: 1; Case/Package: 100; Actuator Length: 2mm; Min Operating Temperature: -40°C; Contact Current Rating: 300mA; REACH SVHC: No SVHC; Throw Configuration: SPDT; Packaging: Tape and Reel; Contact Material: Copper Alloy; Max Current Rating: 300mA; Current Rating: 300mA; Mount: Surface Mount; Lead Free: Lead Free; Termination: Gull Wing; Voltage Rating (DC): 6V; Length: 9mm; Orientation: Right Angle; Contact Plating: Silver
SW?#2-SW?#4 = CMP-1460-00003-6: Switch Tactile Spst-no 0.05A 12V; Manufacturer Lifecycle Status: ACTIVE; Insulation Resistance: 100MΩ; Current Rating: 50mA; YEOL: 1 = Estimated lifetime > 10 years; Min Operating Temperature: -40°C; Max Operating Temperature: 85°C; Contact Current Rating: 50mA; Lifecycle Status: Production; Width: 6mm; Packaging: Tape and Reel; Height: 5mm; RoHS: Compliant; Contact Plating: Silver; Contact Resistance: 100mΩ; Voltage Rating: 12V
SW?#5-SW?#12 = 5123: Description; Manufacturer_Name: Adafruit Industries; Copyright: Copyright (C) 2026 Ultra Librarian. All rights reserved.; Manufacturer_Part_Number: 5123
U?#1 = CC1101RGPR: Low-power Sub-1 GHz wireless transceiver 20-QFN -40 to 85; Manufacturer_Name: Texas Instruments; Copyright: Copyright (C) 2026 Ultra Librarian. All rights reserved.; Manufacturer_Part_Number: CC1101RGPR; RefDes: RefDes; Type: Type
U?#2 = CMP-0243-00169-1: ARM Cortex-M4 32-bit MCU+FPU, 512 KB Flash, 128 KB RAM, 50 I/Os, 64-Pin LQFP, -40 to 85 degC, Tray; Operating Frequency(F) (Processor speed) (MHz): 100; FLASH Size (Prog) (kB): 512; Supply Voltage(Vcc) min (V): 1.7; Internal RAM Size (kB): 128; I/Os (High Current): 50; Packing: Tray; ComponentLink1Description: Manufacturer URL; Package Description: LQFP64; DatasheetVersion: Rev. 6; Mounting Technology: Surface Mount; Package Reference: 64-Pin Low-profile Quad Flat Package, Body 10 x 10 mm, Pitch 0.5 mm; ComponentLink2Description: Datasheet; Core: ARM Cortex-M4; ComponentLink2URL: http://www.st.com/st-web-ui/static/active/en/resource/technical/document/datasheet/DM00115249.pdf; ComponentLink1URL: http://www.st.com/
U?#3 = ESP32-H2FH4: Description; Manufacturer_Name: Espressif Systems; Type: RF; Copyright: Copyright (C) 2025 Ultra Librarian. All rights reserved.; Manufacturer_Part_Number: ESP32-H2FH4; RefDes: RefDes
U?#4 = CMP-04911-000008-1: IC BATT FUEL GAUGE LI-ION 12SON; Manufacturer: Texas Instruments; Number Of Cells: 1; Nominal Supply Current: 93uA; Max Supply Voltage: 4.5V; Standoff Height: 0mm; Min Supply Voltage: 2.45V; Output Voltage: 1.8V; Temperature Range High: +85°C; Temperature: -40°C to +85°C; Device Class L2: Power Management ICs; Device Class L1: Integrated Circuits (ICs); Lead Free: Yes; Height: 1mm; Package: DRZ0012A; Number Of Outputs: 1; ComponentLink2URL: http://www.ti.com/lit/gpn/bq27441-g1; Ambient Temperature Range High: +85°C; Category: IC; Manufacturer Part Number: BQ27441DRZR-G1A; Device Class L3: Battery Management; RoHS: TRUE; Octopart: https://octopart.com/bq27441drzr-g1a-texas+instruments-30555829; Ambient Temperature Range Low: -40°C; Automotive: No; Mouser Description: System-Side Impedance Track? Battery Fuel (Gas) Gauge 12-SON -40 to 85; Digikey Description: IC BATT FUEL GAUGE LI-ION 12SON; Temperature Range Low: -40°C; ComponentLink2Description: Datasheet
U?#5 = CMP-0321-00220-3: IC LI-ION CHARGE MGMT 16-QFN; Fault Protection: Over Voltage; Max Charge Current: 1.5A; Interface: USB; Max Supply Voltage: 10.2V; Number of Cells: 1; Battery Pack Voltage: 4.2V; Min Supply Voltage: 4.35V; Battery Chemistry: LITHIUM-ION; Min Input Voltage: 4.3V; Lead Free: Lead Free; Max Operating Temperature: 125°C; RoHS Compliant: Yes; Contact Plating: Gold; Min Operating Temperature: -40°C; Weight: 0.000808oz; Package Quantity: 3000; Radiation Hardening: No; Case/Package: VQFN; Output Voltage: 4.2V; Packaging: Tape and Reel; Series: -; Output Current: 1.5A; Number of Pins: 16
U?#6 = CMP-04918-000700-1: 1.8-V TO 5.5-V, 75-NA IQ BUCK-BO; RoHS Compliant: Yes
Y?#1-Y?#3 = CMP-200220-000007-1: CRYSTAL 16.0000MHZ 8PF SMD; Frequency Stability: 30ppm; Frequency Tolerance: 20ppm; Frequency: 16MHz; ESR (Equivalent Series Resistance): 80R; Min Operating Temperature: -40°C; Mount: Surface Mount; Width: 0.098inch; Case/Package: SMD/SMT; Max Operating Temperature: 85°C; Number of Pins: 4; Length: 0.126inch; Load Capacitance: 8pF; Packaging: Tape and Reel; Package Quantity: 3000; Height: 0.035inch